# Altium schematic sheet CutMonitor_Opto.SchDoc
size 594 x 420 mm; DocumentNumber: ФНКЦ.452312.001 Э3; SheetNumber: 2; Format: A2
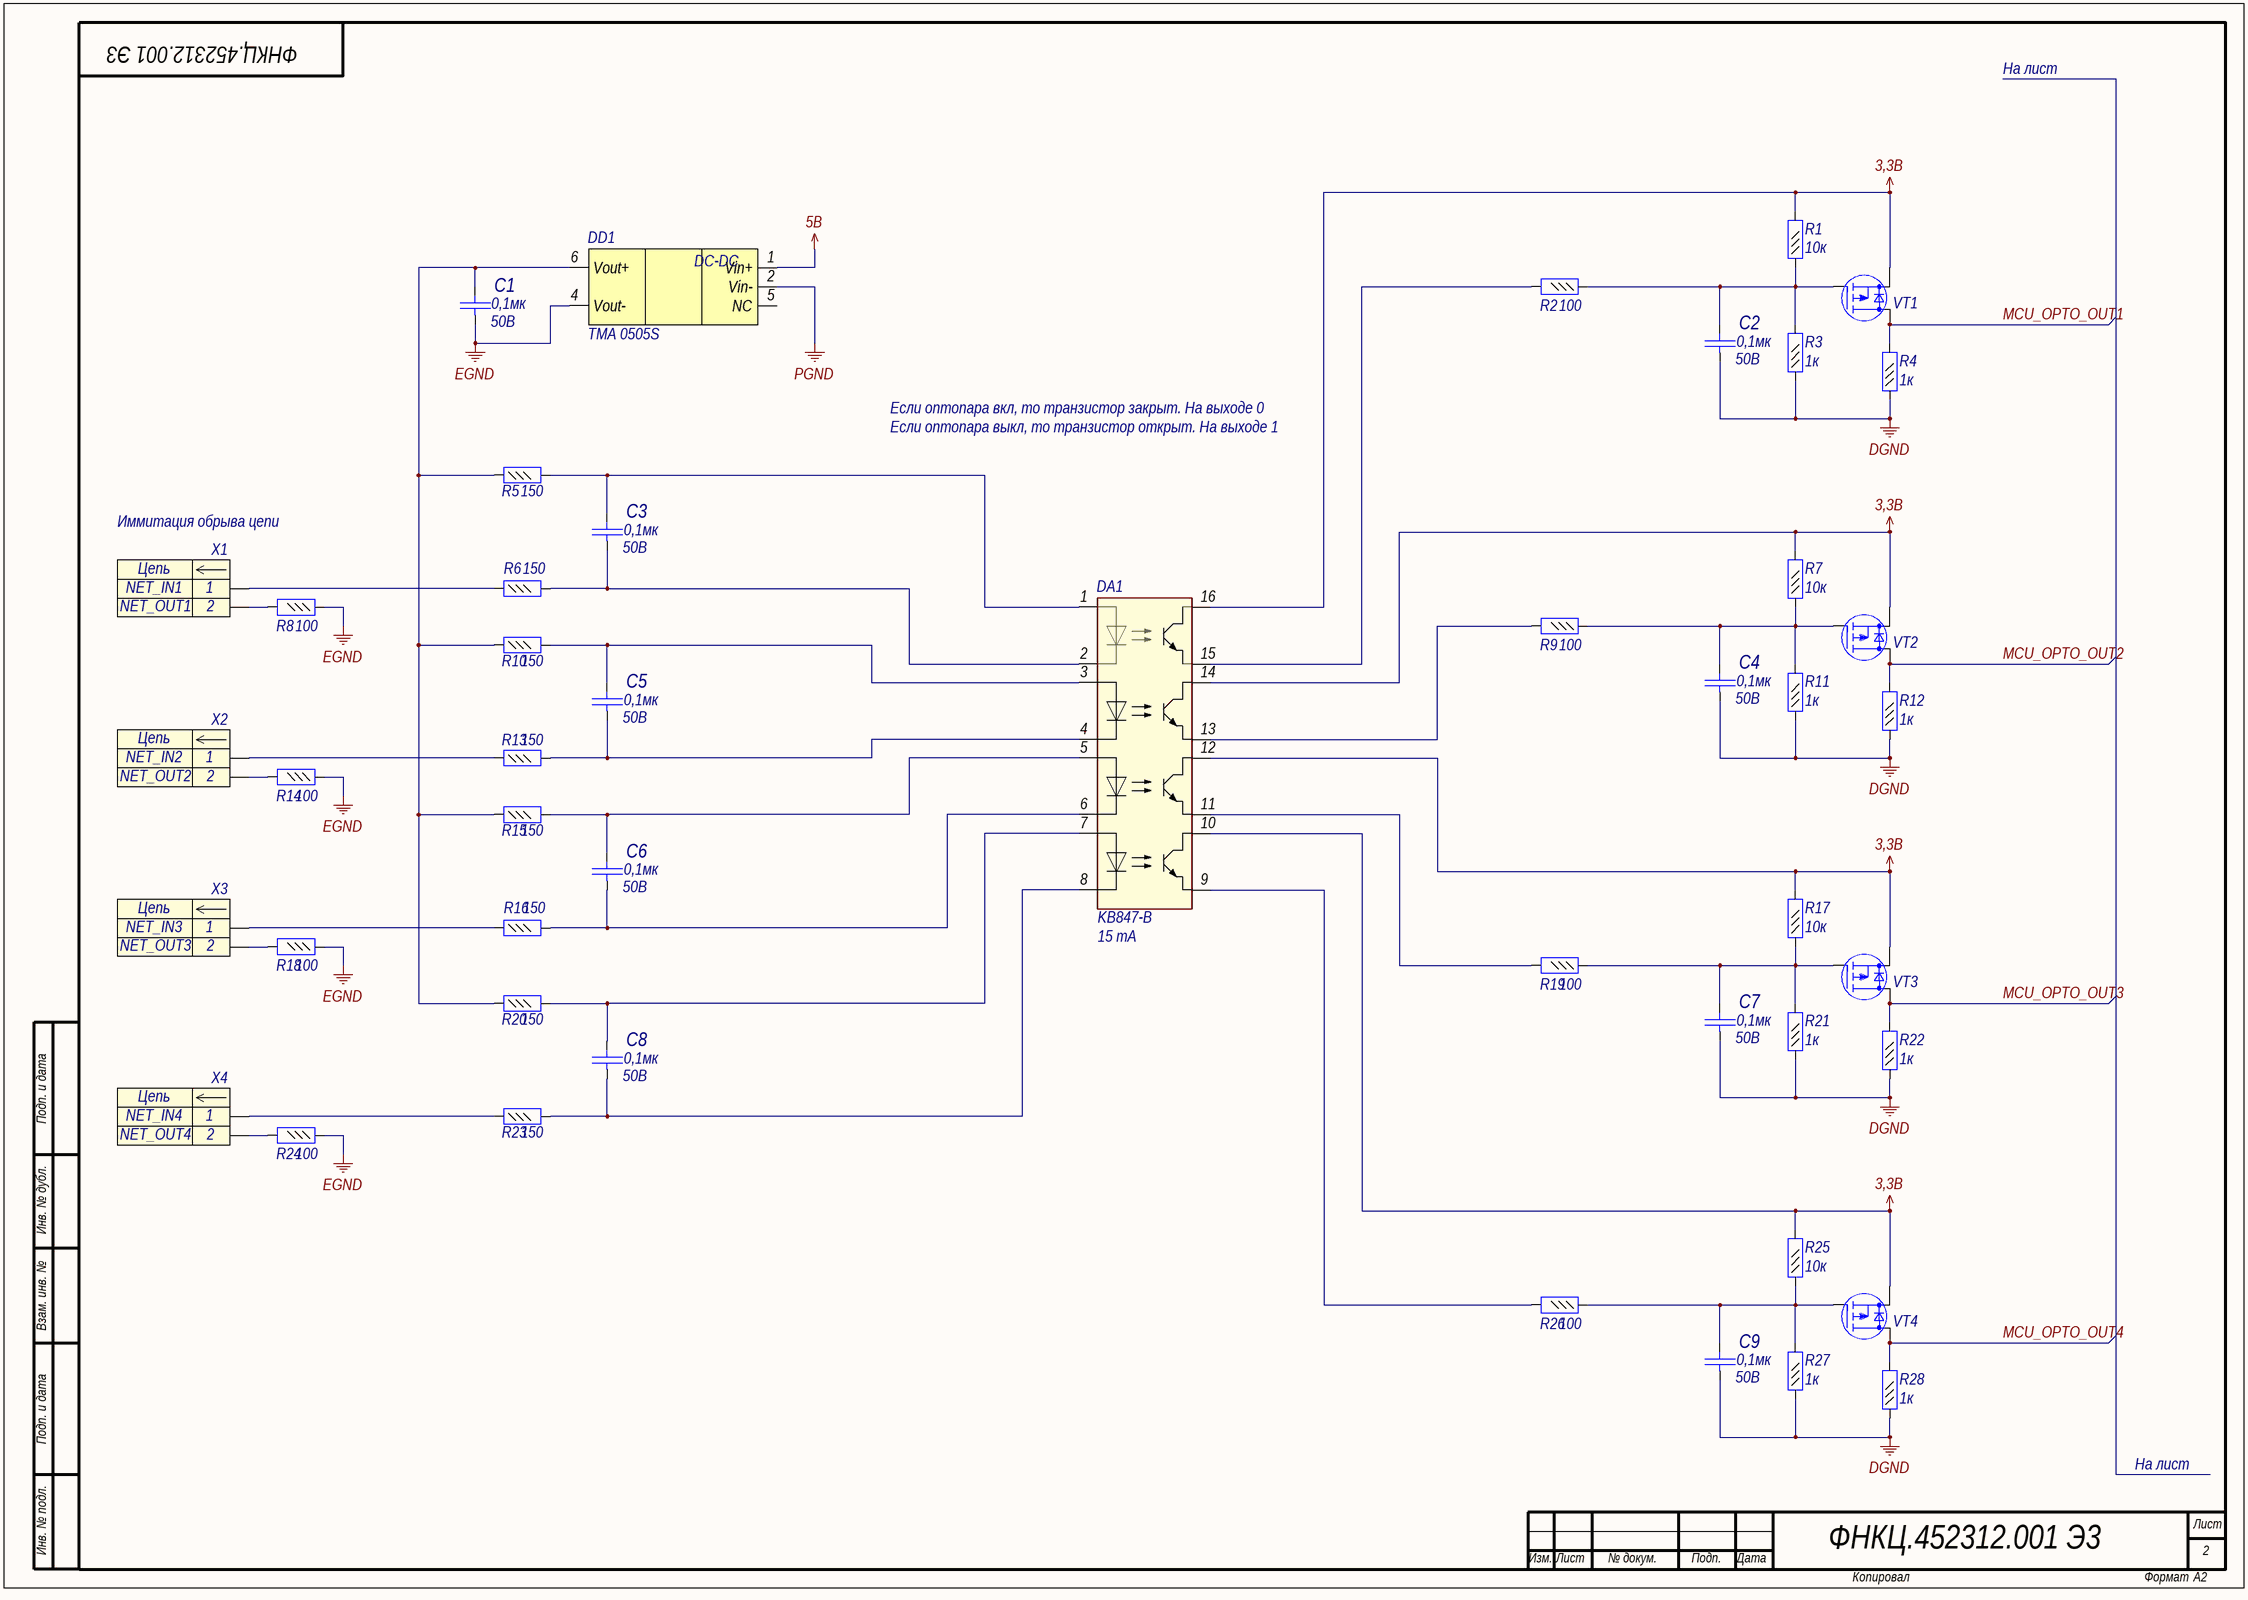
[diagram p0: CutMonitor_Opto.SchDoc]

## Parts
C1  value 0,1мк  Voltage: 50B  [C0603]  (hidden comment: Capacitor)
C2  value 0,1мк  Voltage: 50B  [C0603]  (hidden comment: Capacitor)
C3  value 0,1мк  Voltage: 50B  [C0603]  (hidden comment: Capacitor)
C4  value 0,1мк  Voltage: 50B  [C0603]  (hidden comment: Capacitor)
C5  value 0,1мк  Voltage: 50B  [C0603]  (hidden comment: Capacitor)
C6  value 0,1мк  Voltage: 50B  [C0603]  (hidden comment: Capacitor)
C7  value 0,1мк  Voltage: 50B  [C0603]  (hidden comment: Capacitor)
C8  value 0,1мк  Voltage: 50B  [C0603]  (hidden comment: Capacitor)
C9  value 0,1мк  Voltage: 50B  [C0603]  (hidden comment: Capacitor)
DA1  Part Number: KB847-B  [OPTO-16]  (hidden comment: OPTO-4)
DD1  Part Number: TMA 0505S  [TMH0505]  (hidden comment: TMA)
R1  value 10к  [R0603]  (hidden comment: Resistor_0,062Вт)
R2  value 100  [R0603]  (hidden comment: Resistor_0,062Вт)
R3  value 1к  [R0603]  (hidden comment: Resistor_0,062Вт)
R4  value 1к  [R0603]  (hidden comment: Resistor_0,062Вт)
R5  value 150  [R0603]  (hidden comment: Resistor_0,062Вт)
R6  value 150  [R0603]  (hidden comment: Resistor_0,062Вт)
R7  value 10к  [R0603]  (hidden comment: Resistor_0,062Вт)
R8  value 100  [R0603]  (hidden comment: Resistor_0,062Вт)
R9  value 100  [R0603]  (hidden comment: Resistor_0,062Вт)
R10  value 150  [R0603]  (hidden comment: Resistor_0,062Вт)
R11  value 1к  [R0603]  (hidden comment: Resistor_0,062Вт)
R12  value 1к  [R0603]  (hidden comment: Resistor_0,062Вт)
R13  value 150  [R0603]  (hidden comment: Resistor_0,062Вт)
R14  value 100  [R0603]  (hidden comment: Resistor_0,062Вт)
R15  value 150  [R0603]  (hidden comment: Resistor_0,062Вт)
R16  value 150  [R0603]  (hidden comment: Resistor_0,062Вт)
R17  value 10к  [R0603]  (hidden comment: Resistor_0,062Вт)
R18  value 100  [R0603]  (hidden comment: Resistor_0,062Вт)
R19  value 100  [R0603]  (hidden comment: Resistor_0,062Вт)
R20  value 150  [R0603]  (hidden comment: Resistor_0,062Вт)
R21  value 1к  [R0603]  (hidden comment: Resistor_0,062Вт)
R22  value 1к  [R0603]  (hidden comment: Resistor_0,062Вт)
R23  value 150  [R0603]  (hidden comment: Resistor_0,062Вт)
R24  value 100  [R0603]  (hidden comment: Resistor_0,062Вт)
R25  value 10к  [R0603]  (hidden comment: Resistor_0,062Вт)
R26  value 100  [R0603]  (hidden comment: Resistor_0,062Вт)
R27  value 1к  [R0603]  (hidden comment: Resistor_0,062Вт)
R28  value 1к  [R0603]  (hidden comment: Resistor_0,062Вт)
VT1  P-MOSFET  [SOT23-3]  (value not drawn)
VT2  P-MOSFET  [SOT23-3]  (value not drawn)
VT3  P-MOSFET  [SOT23-3]  (value not drawn)
VT4  P-MOSFET  [SOT23-3]  (value not drawn)
X1  (no value)  [JUMPER_2.54]
X2  (no value)  [JUMPER_2.54]
X3  (no value)  [JUMPER_2.54]
X4  (no value)  [JUMPER_2.54]

## Nets
3,3В: DA1.10 DA1.12 DA1.14 DA1.16 R1.2 R7.2 R17.2 R25.2 VT1.3(S) VT2.3(S) VT3.3(S) VT4.3(S)
5В: DD1.1(Vin+)
DGND: C2.1 C4.1 C7.1 C9.1 R3.1 R4.1 R11.1 R12.1 R21.1 R22.1 R27.1 R28.1
EGND: C1.1 DD1.4(Vout-) R8.1 R14.1 R18.1 R24.1
PGND: DD1.2(Vin-)
MCU_OPTO_OUT1: R4.2 VT1.2(D)
MCU_OPTO_OUT2: R12.2 VT2.2(D)
MCU_OPTO_OUT3: R22.2 VT3.2(D)
MCU_OPTO_OUT4: R28.2 VT4.2(D)
NetC1_2: C1.2 DD1.6(Vout+) R5.1 R10.1 R15.1 R20.1
NetC2_2: C2.2 R1.1 R2.1 R3.2 VT1.1(G)
NetC3_1: C3.1 DA1.2 R6.2
NetC3_2: C3.2 DA1.1 R5.2
NetC4_2: C4.2 R7.1 R9.1 R11.2 VT2.1(G)
NetC5_1: C5.1 DA1.4 R13.2
NetC5_2: C5.2 DA1.3 R10.2
NetC6_1: C6.1 DA1.6 R16.2
NetC6_2: C6.2 DA1.5 R15.2
NetC7_2: C7.2 R17.1 R19.1 R21.2 VT3.1(G)
NetC8_1: C8.1 DA1.8 R23.2
NetC8_2: C8.2 DA1.7 R20.2
NetC9_2: C9.2 R25.1 R26.1 R27.2 VT4.1(G)
NetDA1_9: DA1.9 R26.2
NetDA1_11: DA1.11 R19.2
NetDA1_13: DA1.13 R9.2
NetDA1_15: DA1.15 R2.2
NetR6_1: R6.1 X1.1
NetR8_2: R8.2 X1.2
NetR13_1: R13.1 X2.1
NetR14_2: R14.2 X2.2
NetR16_1: R16.1 X3.1
NetR18_2: R18.2 X3.2
NetR23_1: R23.1 X4.1
NetR24_2: R24.2 X4.2

Not connected (* = marked no-connect by the designer): DD1 5(NC)

## Notes on the sheet
- На лист
- Если оптопара вкл, то транзистор закрыт. На выходе 0
- Если оптопара выкл, то транзистор открыт. На выходе 1
- Иммитация обрыва цепи
- (near DA1) 15 mA
- Подп. и дата
- Инв. № дубл.
- Взам. инв. №
- Инв. № подл.
- Лист
- Изм.
- № докум.
- Подп.
- Дата
- Копировал
- Формат
- (in symbol connect54) Цепь
- (in symbol pwr22) DC-DC

## Library data of the parts
C1-C9 = cap131: Конденсатор; Part Name: Ceramic; Manufacture: Murata; Part Number: GRM188R71H104KA93D; id: cap131; TKE: X7R
DA1 = KB847-B: Опторазвязка х4; Manufacturer: Kingbright; id: opto1; Cut-off frequency: 80kHz; Forward Voltage: 1,2B
DD1 = pwr22: DC/DC преобразователь; Part Name: DC/DC Converter Isolated; Manufacturer: Traco Power; id: pwr22; Input Voltage: 5B; Current: 200mA; Type: Isolated; Output Voltage: 5B
R1 R7 R17 R25 = res483: Резистор; Manufacture: Yageo; Part Number: RC0603FR-0710KL; id: res483; Accuracy: 0,01; Part Name: Resistor; Power: 0,062Вт
R2 R8 R9 R14 R18 R19 R24 R26 = res435: Резистор; Manufacture: Yageo; Part Number: RC0603FR-07100RL; id: res435; Accuracy: 0,01; Part Name: Resistor; Power: 0,062Вт
R3 R4 R11 R12 R21 R22 R27 R28 = res459: Резистор; Manufacture: Yageo; Part Number: RC0603FR-071KL; id: res459; Accuracy: 0,01; Part Name: Resistor; Power: 0,062Вт
R5 R6 R10 R13 R15 R16 R20 R23 = res439: Резистор; Manufacture: Yageo; Part Number: RC0603FR-07150RL; id: res439; Accuracy: 0,01; Part Name: Resistor; Power: 0,062Вт
VT1-VT4 = mosfert5: N-MOSFET; Part Number: IRLML2244TRPbF; Manufacturer: International Rectifier; Structure: p-channel; V drain-source max: (-20B); Rds: 0,054Ohm; Gate-to-source voltage: (+-)12B; Continuous drain current: (-4,3)A; Total gate charge: 6,9nC; Pulsed drain current: (-18)A; Power dissipation: 1,3W; id: mosfert5
X1 = connect54: Разъем - 2 конт. вилка; Part Name: Jumper 2,54mm; Contact_1: NET_IN1; Contact_2: NET_OUT1; Etch: 2,54mm; id: connect54
X2 = connect54: Разъем - 2 конт. вилка; Part Name: Jumper 2,54mm; Contact_1: NET_IN2; Contact_2: NET_OUT2; Etch: 2,54mm; id: connect54
X3 = connect54: Разъем - 2 конт. вилка; Part Name: Jumper 2,54mm; Contact_1: NET_IN3; Contact_2: NET_OUT3; Etch: 2,54mm; id: connect54
X4 = connect54: Разъем - 2 конт. вилка; Part Name: Jumper 2,54mm; Contact_1: NET_IN4; Contact_2: NET_OUT4; Etch: 2,54mm; id: connect54